# Altium schematic sheet SPI_Encoder.SchDoc
size A4; SheetNumber: 4; SheetTotal: 6
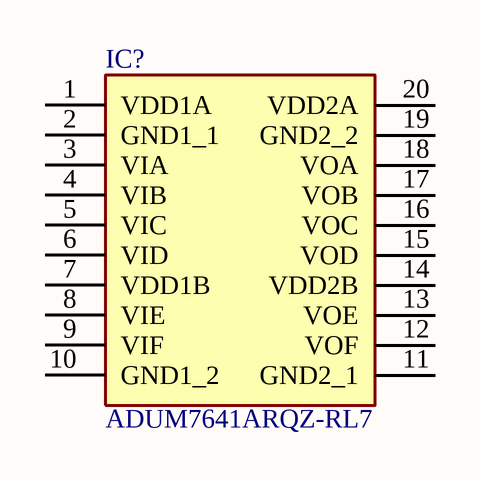
[diagram p0: SPI_Encoder.SchDoc]

## Parts
IC?  ADUM7641ARQZ-RL7  [SOP64P600X175-20N]

## Nets

Not connected (* = marked no-connect by the designer): IC? 1(VDD1A) 2(GND1_1) 3(VIA) 4(VIB) 5(VIC) 6(VID) 7(VDD1B) 8(VIE) 9(VIF) 10(GND1_2) 11(GND2_1) 12(VOF) 13(VOE) 14(VDD2B) 15(VOD) 16(VOC) 17(VOB) 18(VOA) 19(GND2_2) 20(VDD2A)

## Library data of the parts
IC? = ADUM7641ARQZ-RL7: Integrated Circuit; Manufacturer_Name: Analog Devices; Datasheet Link: https://www.digikey.com/en/products/detail/analog-devices-inc/ADUM7641ARQZ-RL7/3775261; Height: 1.75mm; Manufacturer_Part_Number: ADUM7641ARQZ-RL7; Mouser Part Number: 584-ADUM7641ARQZ-R7; Mouser Price/Stock: https://www.mouser.co.uk/ProductDetail/Analog-Devices/ADUM7641ARQZ-RL7?qs=WIvQP4zGang774UOJYPSnw%3D%3D; Arrow Part Number: ADUM7641ARQZ-RL7; Arrow Price/Stock: https://www.arrow.com/en/products/adum7641arqz-rl7/analog-devices?region=nac